# EAGLE schematic Ne555 v4 (EAGLE 9.7.0)
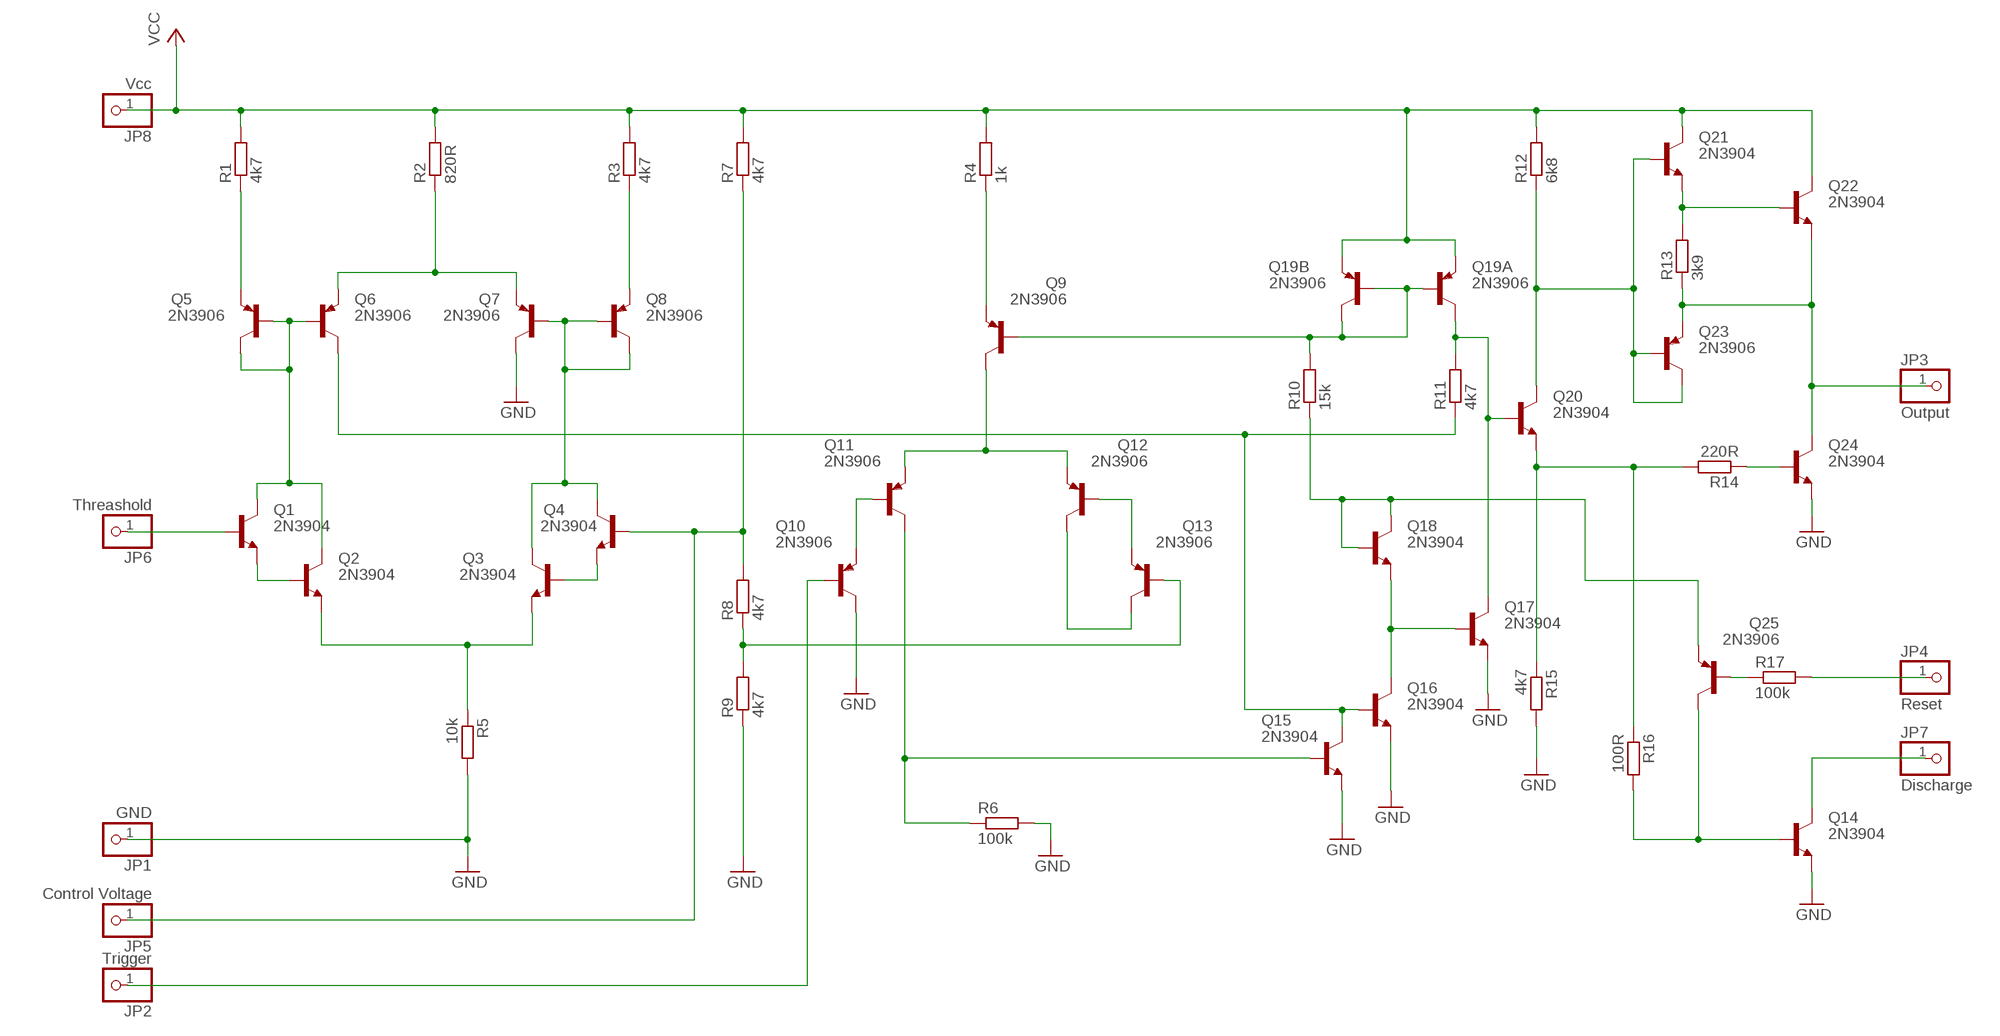
[diagram p0: schematic, sheet 1]

## Parts
JP1  GND  PINHD-1X1  [1X01]
JP2  Trigger  PINHD-1X1  [1X01]
JP3  Output  PINHD-1X1  [1X01]
JP4  Reset  PINHD-1X1  [1X01]
JP5  Control Voltage  PINHD-1X1  [1X01]
JP6  Threashold  PINHD-1X1  [1X01]
JP7  Discharge  PINHD-1X1  [1X01]
JP8  Vcc  PINHD-1X1  [1X01]
Q1  2N3904  2N3904-NPN-TO92-EBC  [TO92-EBC]
Q2  2N3904  2N3904-NPN-TO92-EBC  [TO92-EBC]
Q3  2N3904  2N3904-NPN-TO92-EBC  [TO92-EBC]
Q4  2N3904  2N3904-NPN-TO92-EBC  [TO92-EBC]
Q5  2N3906  2N3906-PNP-TO92-EBC  [TO92-EBC]
Q6  2N3906  2N3906-PNP-TO92-EBC  [TO92-EBC]
Q7  2N3906  2N3906-PNP-TO92-EBC  [TO92-EBC]
Q8  2N3906  2N3906-PNP-TO92-EBC  [TO92-EBC]
Q9  2N3906  2N3906-PNP-TO92-EBC  [TO92-EBC]
Q10  2N3906  2N3906-PNP-TO92-EBC  [TO92-EBC]
Q11  2N3906  2N3906-PNP-TO92-EBC  [TO92-EBC]
Q12  2N3906  2N3906-PNP-TO92-EBC  [TO92-EBC]
Q13  2N3906  2N3906-PNP-TO92-EBC  [TO92-EBC]
Q14  2N3904  2N3904-NPN-TO92-EBC  [TO92-EBC]
Q15  2N3904  2N3904-NPN-TO92-EBC  [TO92-EBC]
Q16  2N3904  2N3904-NPN-TO92-EBC  [TO92-EBC]
Q17  2N3904  2N3904-NPN-TO92-EBC  [TO92-EBC]
Q18  2N3904  2N3904-NPN-TO92-EBC  [TO92-EBC]
Q19A  2N3906  2N3906-PNP-TO92-EBC  [TO92-EBC]
Q19B  2N3906  2N3906-PNP-TO92-EBC  [TO92-EBC]
Q20  2N3904  2N3904-NPN-TO92-EBC  [TO92-EBC]
Q21  2N3904  2N3904-NPN-TO92-EBC  [TO92-EBC]
Q22  2N3904  2N3904-NPN-TO92-EBC  [TO92-EBC]
Q23  2N3906  2N3906-PNP-TO92-EBC  [TO92-EBC]
Q24  2N3904  2N3904-NPN-TO92-EBC  [TO92-EBC]
Q25  2N3906  2N3906-PNP-TO92-EBC  [TO92-EBC]
R1  4k7  R-EU_0204/7  [0204/7]
R2  820R  R-EU_0204/7  [0204/7]
R3  4k7  R-EU_0204/7  [0204/7]
R4  1k  R-EU_0204/7  [0204/7]
R5  10k  R-EU_0204/7  [0204/7]
R6  100k  R-EU_0204/7  [0204/7]
R7  4k7  R-EU_0204/7  [0204/7]
R8  4k7  R-EU_0204/7  [0204/7]
R9  4k7  R-EU_0204/7  [0204/7]
R10  15k  R-EU_0204/7  [0204/7]
R11  4k7  R-EU_0204/7  [0204/7]
R12  6k8  R-EU_0204/7  [0204/7]
R13  3k9  R-EU_0204/7  [0204/7]
R14  220R  R-EU_0204/7  [0204/7]
R15  4k7  R-EU_0204/7  [0204/7]
R16  100R  R-EU_0204/7  [0204/7]
R17  100k  R-EU_0204/7  [0204/7]

## Nets
GND: JP1.1 Q7.C Q10.C Q14.E Q15.E Q16.E Q17.E Q24.E R5.2 R6.2 R9.1 R15.2
N$1: Q10.E Q11.B
N$2: Q1.C Q2.C Q5.B Q5.C Q6.B
N$3: Q11.C Q15.B R6.1
N$4: Q1.E Q2.B
N$5: Q5.E R1.1
N$6: Q12.B Q13.E
N$7: Q6.E Q7.E R2.1
N$8: Q12.C Q13.C
N$9: Q3.C Q4.C Q7.B Q8.B Q8.C
N$10: Q9.C Q11.E Q12.E
N$11: Q8.E R3.1
N$12: Q16.C Q17.B Q18.E
N$13: JP6.1 Q1.B
N$14: Q2.E Q3.E R5.1
N$15: Q3.B Q4.E
N$16: JP2.1 Q10.B
N$17: Q20.E R14.2 R15.1 R16.1
N$18: JP5.1 Q4.B R7.1 R8.2
N$19: Q13.B R8.1 R9.2
N$20: Q9.E R4.1
N$21: Q21.E Q22.B R13.2
N$22: JP3.1 Q22.E Q23.E Q24.C R13.1
N$23: Q9.B Q19A.B Q19B.B Q19B.C R10.2
N$24: Q17.C Q19A.C Q20.B R11.2
N$25: Q20.C Q21.B Q23.B Q23.C R12.1
N$27: Q24.B R14.1
N$28: Q6.C Q15.C Q16.B R11.1
N$29: Q18.B Q18.C Q25.E R10.1
N$31: Q14.B Q25.C R16.2
N$32: JP4.1 R17.2
N$33: JP7.1 Q14.C
N$34: Q25.B R17.1
VCC: JP8.1 Q19A.E Q19B.E Q21.C Q22.C R1.2 R2.2 R3.2 R4.2 R7.2 R12.2

## Library data of the parts
JP1-JP8 = pinhead:PINHD-1X1: PIN HEADER
Q1-Q4 Q14-Q18 Q20-Q22 Q24 = transistor-neu-to92:*-NPN-: NPN Transistror
Q5-Q13 Q19A Q19B Q23 Q25 = transistor-neu-to92:*-PNP-: PNP Transistror
R1-R17 = resistor:R-EU_: RESISTOR, European symbol